# Altium schematic sheet communication.SchDoc
size A4; SheetNumber: 8
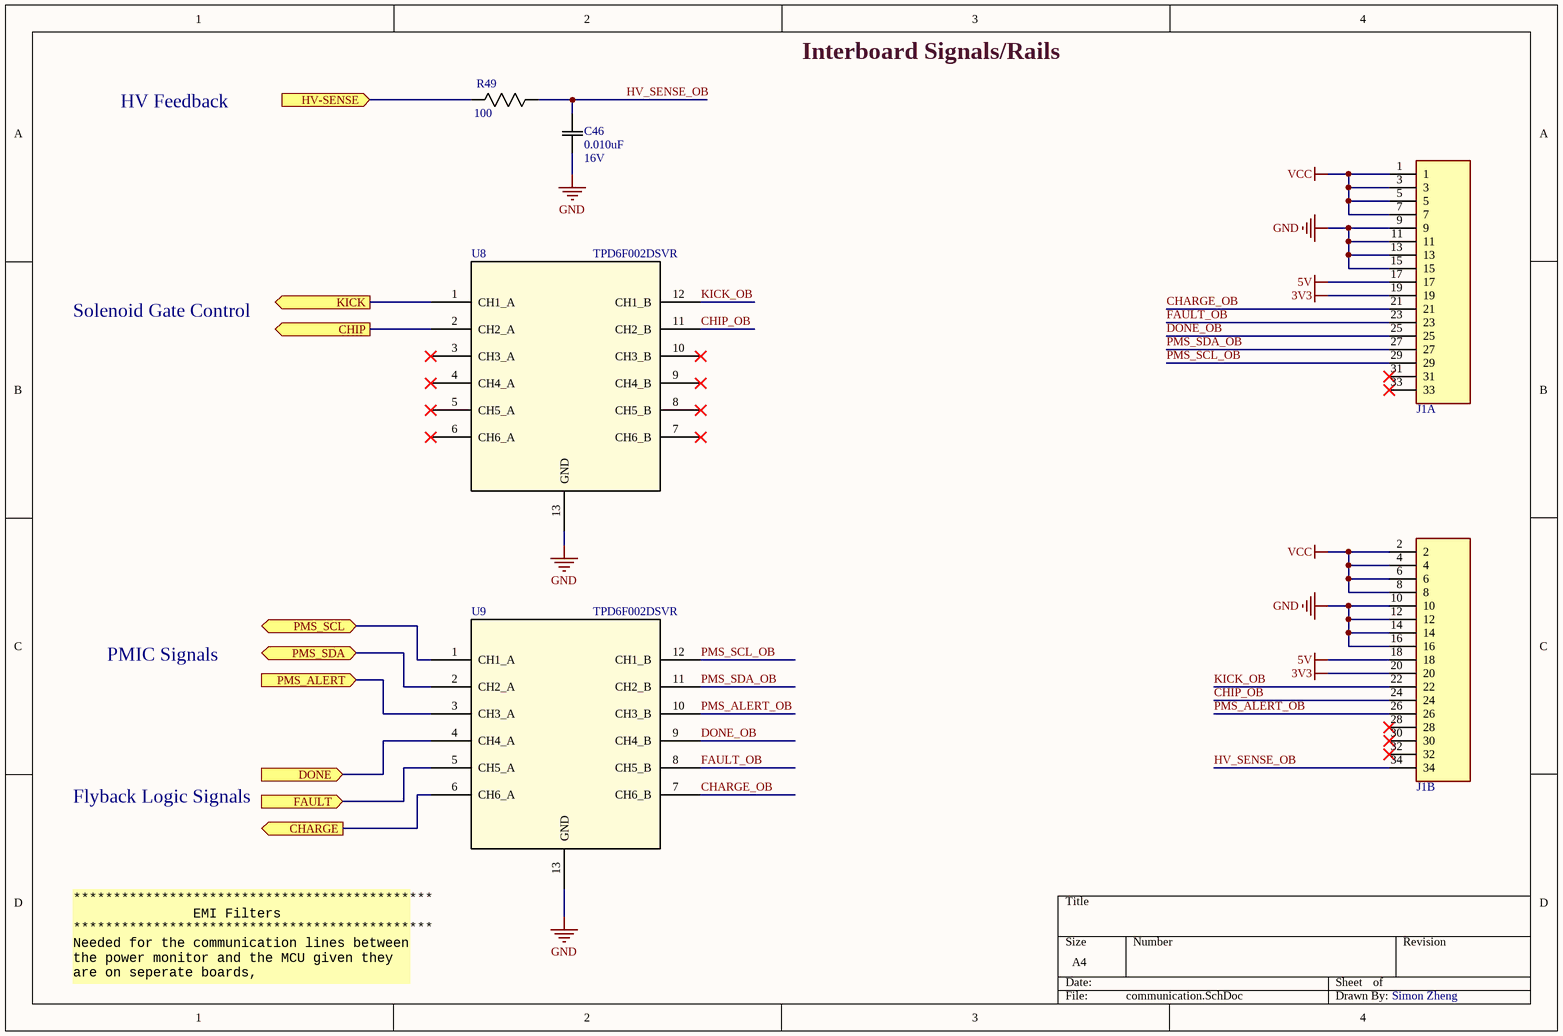
[diagram p0: communication.SchDoc]

## Parts
C46  Rating: 16V  [0805]  (hidden comment: 0.010uF)
J1  0.1" Header Female 34  [SAMTEC_ESQ-117-12-L-D]  (value not drawn)  (parts A,B of 2)
R49  100  [0805]
U8  TPD6F002DSVR  [PSON50P140X80_HS-13N]
U9  TPD6F002DSVR  [PSON50P140X80_HS-13N]

## Ports
CHARGE (out), CHIP (out), DONE (in), FAULT (in), HV-SENSE (in), KICK (out), PMS_ALERT (in), PMS_SCL (bidir), PMS_SDA (bidir)

## Nets
3V3: J1.19 J1.20
5V: J1.17 J1.18
GND: C46.2(C2) J1.9 J1.10 J1.11 J1.12 J1.13 J1.14 J1.15 J1.16 U8.13(GND) U9.13(GND)
VCC: J1.1 J1.2 J1.3 J1.4 J1.5 J1.6 J1.7 J1.8
CHARGE: U9.6(CH6_A) ; port CHARGE
CHARGE_OB: J1.21 U9.7(CH6_B)
CHIP: U8.2(CH2_A) ; port CHIP
CHIP_OB: J1.24 U8.11(CH2_B)
DONE: U9.4(CH4_A) ; port DONE
DONE_OB: J1.25 U9.9(CH4_B)
FAULT: U9.5(CH5_A) ; port FAULT
FAULT_OB: J1.23 U9.8(CH5_B)
HV-SENSE: R49.2(R2) ; port HV-SENSE
HV_SENSE_OB: C46.1(C1) J1.34 R49.1(R1)
KICK: U8.1(CH1_A) ; port KICK
KICK_OB: J1.22 U8.12(CH1_B)
PMS_ALERT: U9.3(CH3_A) ; port PMS_ALERT
PMS_ALERT_OB: J1.26 U9.10(CH3_B)
PMS_SCL: U9.1(CH1_A) ; port PMS_SCL
PMS_SCL_OB: J1.29 U9.12(CH1_B)
PMS_SDA: U9.2(CH2_A) ; port PMS_SDA
PMS_SDA_OB: J1.27 U9.11(CH2_B)

Not connected (* = marked no-connect by the designer): J1 28* 30* 31* 32* 33*; U8 3(CH3_A)* 4(CH4_A)* 5(CH5_A)* 6(CH6_A)* 7(CH6_B)* 8(CH5_B)* 9(CH4_B)* 10(CH3_B)*

## Notes on the sheet
- HV Feedback
- Interboard Signals/Rails
- Solenoid Gate Control
- PMIC Signals
- Flyback Logic Signals
- *********************************************
  EMI Filters
  *********************************************
  Needed for the communication lines between the power monitor and the MCU given they are on seperate boards,
- Simon Zheng

## Library data of the parts
C46 = CAP 0.010uF 16V: CAP CER 0.010UF 16V X5R 0603/0805; Tolerance: 10%; Package: 0603/0805; Temperature Coefficient: X5R; Operating Temperature: -55°C ~ 85°C; Value: 0.010uF
J1 = CN HDR 34POS 2x17: Female Header THRU 34POS 2ROW 0.1" (2.54mm) pitch
R49 = RES 100.0 1/8W: RES SMD 100 OHM 5% 1/8W 0805; Power (Watts): 0.125W; Package: 0805; Value: 100; Tolerance: 5%
U8 U9 = EMI FILTER TPD6F002DSVR: 6-Channel EMI Filter for Display Interface; Manufacturer: Texas Instruments; INDUSTRY_STD_PKG_TYPE: SON; FAMILY_NAME: EMI Solution; PIN_COUNT: 12; PACKAGE_DESIGNATOR: DSV; Datasheet_URL: http://www.ti.com/lit/gpn/TPD6F002; GENERIC_PART_NUMBER: TPD6F002; Vendor: Texas Instruments; Manufacturer_Part_Number: TPD6F002DSVR; Copyright: Copyright (C) 2018 Accelerated Designs. All rights reserved; RefDes: RefDes; Type: DEV